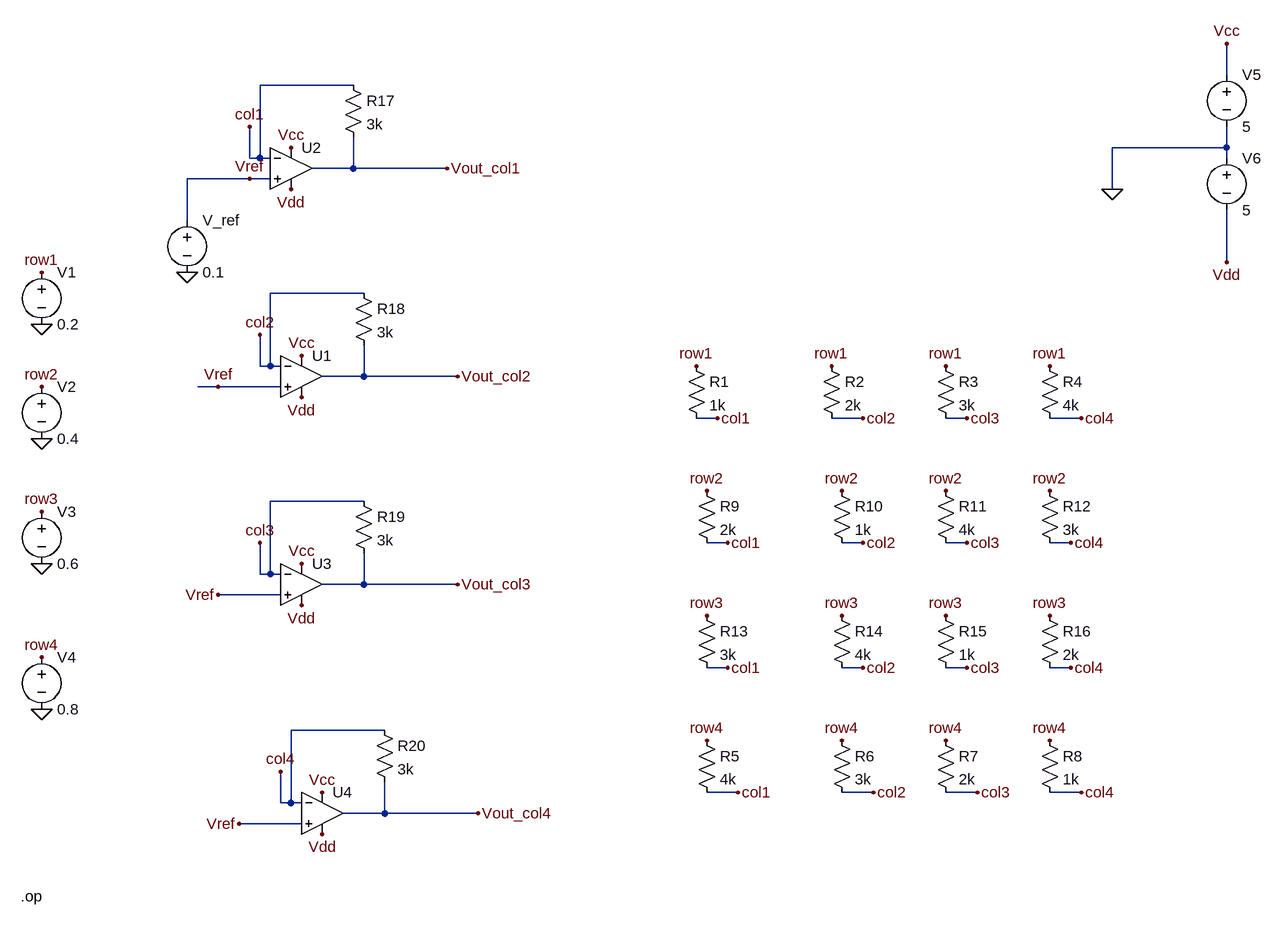
[diagram p0: schematic crossbar_positve array.asc]
crossbar_positve array.asc, the LTspice schematic file:
Version 4.1
SHEET 1 1092 732
WIRE 464 -560 464 -608
WIRE -880 -544 -1024 -544
WIRE 464 -448 464 -480
WIRE 464 -448 288 -448
WIRE -1040 -432 -1040 -480
WIRE -1024 -432 -1024 -544
WIRE -1024 -432 -1040 -432
WIRE -1008 -432 -1024 -432
WIRE 464 -432 464 -448
WIRE -880 -416 -880 -464
WIRE -880 -416 -944 -416
WIRE -736 -416 -880 -416
WIRE -1040 -400 -1136 -400
WIRE -1008 -400 -1040 -400
WIRE 288 -384 288 -448
WIRE -1136 -336 -1136 -400
WIRE 464 -272 464 -352
WIRE -864 -224 -1008 -224
WIRE -1024 -112 -1024 -160
WIRE -1008 -112 -1008 -224
WIRE -1008 -112 -1024 -112
WIRE -992 -112 -1008 -112
WIRE -864 -96 -864 -144
WIRE -864 -96 -928 -96
WIRE -720 -96 -864 -96
WIRE -1088 -80 -1120 -80
WIRE -992 -80 -1088 -80
WIRE -320 -32 -352 -32
WIRE -96 -32 -144 -32
WIRE 64 -32 32 -32
WIRE 240 -32 192 -32
WIRE -864 96 -1008 96
WIRE -304 160 -336 160
WIRE -96 160 -128 160
WIRE 64 160 32 160
WIRE 224 160 192 160
WIRE -1024 208 -1024 160
WIRE -1008 208 -1008 96
WIRE -1008 208 -1024 208
WIRE -992 208 -1008 208
WIRE -864 224 -864 176
WIRE -864 224 -928 224
WIRE -720 224 -864 224
WIRE -992 240 -1088 240
WIRE -304 352 -336 352
WIRE -96 352 -128 352
WIRE 64 352 32 352
WIRE 224 352 192 352
WIRE -832 448 -976 448
WIRE -288 544 -336 544
WIRE -80 544 -128 544
WIRE 80 544 32 544
WIRE 240 544 192 544
WIRE -992 560 -992 512
WIRE -976 560 -976 448
WIRE -976 560 -992 560
WIRE -960 560 -976 560
WIRE -832 576 -832 528
WIRE -832 576 -896 576
WIRE -688 576 -832 576
WIRE -960 592 -1056 592
FLAG -352 -112 row1
FLAG -144 -112 row1
FLAG 32 -112 row1
FLAG 192 -112 row1
FLAG -336 80 row2
FLAG -128 80 row2
FLAG 32 80 row2
FLAG 192 80 row2
FLAG -336 272 row3
FLAG -128 272 row3
FLAG 32 272 row3
FLAG 192 272 row3
FLAG -336 464 row4
FLAG -128 464 row4
FLAG 32 464 row4
FLAG 192 464 row4
FLAG -288 544 col1
FLAG -320 -32 col1
FLAG -304 160 col1
FLAG -304 352 col1
FLAG -96 -32 col2
FLAG -96 160 col2
FLAG -96 352 col2
FLAG -80 544 col2
FLAG 64 -32 col3
FLAG 64 160 col3
FLAG 64 352 col3
FLAG 80 544 col3
FLAG 240 -32 col4
FLAG 224 160 col4
FLAG 224 352 col4
FLAG 240 544 col4
FLAG -1360 192 0
FLAG -1360 416 0
FLAG -1360 0 0
FLAG -1360 -176 0
FLAG -1360 -256 row1
FLAG -1360 -80 row2
FLAG -1360 112 row3
FLAG -1360 336 row4
FLAG -1136 -256 0
FLAG -1040 -480 col1
FLAG -976 -448 Vcc
FLAG 464 -608 Vcc
FLAG -976 -384 Vdd
FLAG 464 -272 Vdd
FLAG 288 -384 0
FLAG -736 -416 Vout_col1
FLAG -1024 -160 col2
FLAG -960 -128 Vcc
FLAG -960 -64 Vdd
FLAG -720 -96 Vout_col2
FLAG -1024 160 col3
FLAG -960 192 Vcc
FLAG -960 256 Vdd
FLAG -720 224 Vout_col3
FLAG -992 512 col4
FLAG -928 544 Vcc
FLAG -928 608 Vdd
FLAG -688 576 Vout_col4
FLAG -1088 -80 Vref
FLAG -1088 240 Vref
FLAG -1056 592 Vref
FLAG -1040 -400 Vref
SYMBOL res -368 -128 R0
SYMATTR InstName R1
SYMATTR Value 1k
SYMBOL res -160 -128 R0
SYMATTR InstName R2
SYMATTR Value 2k
SYMBOL res 16 -128 R0
SYMATTR InstName R3
SYMATTR Value 3k
SYMBOL res 176 -128 R0
SYMATTR InstName R4
SYMATTR Value 4k
SYMBOL res -352 448 R0
SYMATTR InstName R5
SYMATTR Value 4k
SYMBOL res -144 448 R0
SYMATTR InstName R6
SYMATTR Value 3k
SYMBOL res 16 448 R0
SYMATTR InstName R7
SYMATTR Value 2k
SYMBOL res 176 448 R0
SYMATTR InstName R8
SYMATTR Value 1k
SYMBOL res -352 64 R0
SYMATTR InstName R9
SYMATTR Value 2k
SYMBOL res -144 64 R0
SYMATTR InstName R10
SYMATTR Value 1k
SYMBOL res 16 64 R0
SYMATTR InstName R11
SYMATTR Value 4k
SYMBOL res 176 64 R0
SYMATTR InstName R12
SYMATTR Value 3k
SYMBOL res -352 256 R0
SYMATTR InstName R13
SYMATTR Value 3k
SYMBOL res -144 256 R0
SYMATTR InstName R14
SYMATTR Value 4k
SYMBOL res 16 256 R0
SYMATTR InstName R15
SYMATTR Value 1k
SYMBOL res 176 256 R0
SYMATTR InstName R16
SYMATTR Value 2k
SYMBOL voltage -1360 -272 R0
SYMATTR InstName V1
SYMATTR Value 0.2
SYMBOL voltage -1360 -96 R0
SYMATTR InstName V2
SYMATTR Value 0.4
SYMBOL voltage -1360 96 R0
SYMATTR InstName V3
SYMATTR Value 0.6
SYMBOL voltage -1360 320 R0
SYMATTR InstName V4
SYMATTR Value 0.8
SYMBOL voltage -1136 -352 R0
SYMATTR InstName V_ref
SYMATTR Value 0.1
SYMBOL res -896 -560 R0
SYMATTR InstName R17
SYMATTR Value 3k
SYMBOL voltage 464 -576 R0
WINDOW 123 0 0 Left 0
WINDOW 39 0 0 Left 0
SYMATTR InstName V5
SYMATTR Value 5
SYMBOL voltage 464 -448 R0
SYMATTR InstName V6
SYMATTR Value 5
SYMBOL OpAmps\\UniversalOpAmp2 -976 -416 R0
SYMATTR InstName U2
SYMBOL res -880 -240 R0
SYMATTR InstName R18
SYMATTR Value 3k
SYMBOL OpAmps\\UniversalOpAmp2 -960 -96 R0
SYMATTR InstName U1
SYMBOL res -880 80 R0
SYMATTR InstName R19
SYMATTR Value 3k
SYMBOL OpAmps\\UniversalOpAmp2 -960 224 R0
SYMATTR InstName U3
SYMBOL res -848 432 R0
SYMATTR InstName R20
SYMATTR Value 3k
SYMBOL OpAmps\\UniversalOpAmp2 -928 576 R0
SYMATTR InstName U4
TEXT -1392 704 Left 2 !.op

The netlist it stands for:
* crossbar_positve array.asc
R1 row1 col1 1k
R2 row1 col2 2k
R3 row1 col3 3k
R4 row1 col4 4k
R5 row4 col1 4k
R6 row4 col2 3k
R7 row4 col3 2k
R8 row4 col4 1k
R9 row2 col1 2k
R10 row2 col2 1k
R11 row2 col3 4k
R12 row2 col4 3k
R13 row3 col1 3k
R14 row3 col2 4k
R15 row3 col3 1k
R16 row3 col4 2k
V1 row1 0 0.2
V2 row2 0 0.4
V3 row3 0 0.6
V4 row4 0 0.8
V_ref Vref 0 0.1
R17 col1 Vout_col1 3k
V5 Vcc 0 5
V6 0 Vdd 5
X§U2 Vref col1 Vcc Vdd Vout_col1 level2 Avol=1Meg GBW=10Meg Slew=10Meg Ilimit=25m Rail=0 Vos=0 En=0 Enk=0 In=0 Ink=0 Rin=500Meg  ; pins In+ In- V+ V- OUT
R18 col2 Vout_col2 3k
X§U1 Vref col2 Vcc Vdd Vout_col2 level2 Avol=1Meg GBW=10Meg Slew=10Meg Ilimit=25m Rail=0 Vos=0 En=0 Enk=0 In=0 Ink=0 Rin=500Meg  ; pins In+ In- V+ V- OUT
R19 col3 Vout_col3 3k
X§U3 Vref col3 Vcc Vdd Vout_col3 level2 Avol=1Meg GBW=10Meg Slew=10Meg Ilimit=25m Rail=0 Vos=0 En=0 Enk=0 In=0 Ink=0 Rin=500Meg  ; pins In+ In- V+ V- OUT
R20 col4 Vout_col4 3k
X§U4 Vref col4 Vcc Vdd Vout_col4 level2 Avol=1Meg GBW=10Meg Slew=10Meg Ilimit=25m Rail=0 Vos=0 En=0 Enk=0 In=0 Ink=0 Rin=500Meg  ; pins In+ In- V+ V- OUT
.op
.lib UniversalOpAmp2.lib
.backanno
.end